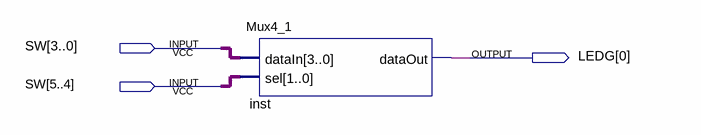
[diagram p0: schematic sheet]
// Quartus schematic Mux4_1Demo.bdf as structural Verilog: 1 symbols, 3 pins
module Mux4_1Demo (
  input  [5:0] SW,
  output [0:0] LEDG
);

  Mux4_1 inst (.dataIn(SW[3:0]), .sel(SW[5:4]), .dataOut(LEDG[0]));
endmodule
